# EAGLE schematic display_board (EAGLE 9.0.1)
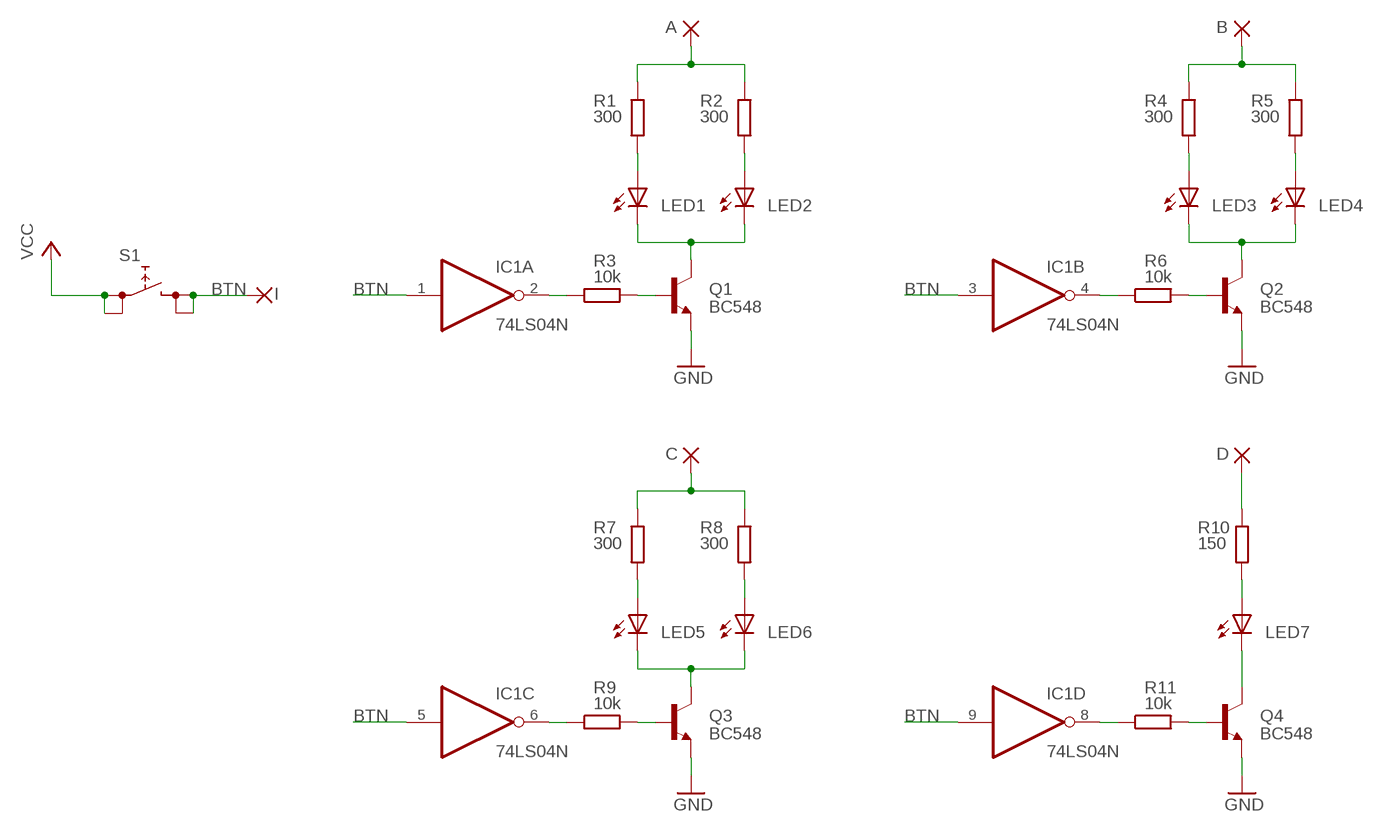
[diagram p0: schematic, sheet 1]

## Parts
A  1,6/0,9  [1,6/0,9]
B  1,6/0,9  [1,6/0,9]
C  1,6/0,9  [1,6/0,9]
D  1,6/0,9  [1,6/0,9]
I  1,6/0,9  [1,6/0,9]
IC1  74LS04N  [DIL14]
LED1  LED3MM  [LED3MM]
LED2  LED3MM  [LED3MM]
LED3  LED3MM  [LED3MM]
LED4  LED3MM  [LED3MM]
LED5  LED3MM  [LED3MM]
LED6  LED3MM  [LED3MM]
LED7  LED3MM  [LED3MM]
Q1  BC548  [TO92-EBC]
Q2  BC548  [TO92-EBC]
Q3  BC548  [TO92-EBC]
Q4  BC548  [TO92-EBC]
R1  300  R-EU_0207/10  [0207/10]
R2  300  R-EU_0207/10  [0207/10]
R3  10k  R-EU_0207/10  [0207/10]
R4  300  R-EU_0207/10  [0207/10]
R5  300  R-EU_0207/10  [0207/10]
R6  10k  R-EU_0207/10  [0207/10]
R7  300  R-EU_0207/10  [0207/10]
R8  300  R-EU_0207/10  [0207/10]
R9  10k  R-EU_0207/10  [0207/10]
R10  150  R-EU_0207/10  [0207/10]
R11  10k  R-EU_0207/10  [0207/10]
S1  REKN  [REKN]

## Nets
BTN: I.1(P) IC1.1(A:I) IC1.3(B:I) IC1.5(C:I) IC1.9(D:I) S1.1A S1.1B
GND: Q1.E Q2.E Q3.E Q4.E
N$1: Q3.B R9.2
N$2: LED1.A R1.2
N$3: Q1.B R3.2
N$4: LED5.A R7.2
N$5: LED2.A R2.2
N$6: LED1.K(C) LED2.K(C) Q1.C
N$7: Q2.B R6.2
N$8: LED3.A R4.2
N$9: LED4.A R5.2
N$10: LED3.K(C) LED4.K(C) Q2.C
N$11: IC1.4(B:O) R6.1
N$12: B.1(P) R4.1 R5.1
N$13: LED6.A R8.2
N$14: LED5.K(C) LED6.K(C) Q3.C
N$15: IC1.6(C:O) R9.1
N$16: D.1(P) R10.1
N$17: Q4.B R11.2
N$18: LED7.A R10.2
N$19: C.1(P) R7.1 R8.1
N$20: LED7.K(C) Q4.C
N$21: IC1.8(D:O) R11.1
N$23: IC1.2(A:O) R3.1
N$24: A.1(P) R1.1 R2.1
VCC: S1.0A S1.0B
Unconnected: IC1.10(E:O) IC1.11(E:I) IC1.12(F:O) IC1.13(F:I)

## Power pins joined to a net without a drawn wire
GND: IC1.7(P:GND)
VCC: IC1.14(P:VCC)

## Library data of the parts
A B C D I = wirepad:1,6/0,9: THROUGH-HOLE PAD
IC1 = 74xx-eu:74*04: Hex INVERTER
LED1-LED7 = led:LED: LED OSRAM: - CHIPLED LG R971, LG N971, LY N971, LG Q971, LY Q971, LO R971, LY R971 LH N974, LH R974 LS Q976, LO Q976, LY Q976 LO Q996 - Hyper CHIPLED LW Q18S LB Q993, LB Q99A, LB R99A - SideLED LS A670, LO A670, LY A670, LG A670, LP A670 LB A673, LV A673, LT A673, LW A673 LH A674 LY A675 LS A676, LA A676, LO A676, LY A676, LW A676 LS A679, LY A679, LG A679 - Hyper Micro SIDELED® LS Y876, LA Y876, LO Y876, LY Y876 LT Y87S - SmartLED LW L88C, LW L88S LB L89C, LB L89S, LG L890 LS L89K, LO L89K, LY L89K LS L896, LA L896, LO L896, LY L896 - TOPLED LS T670, LO T670, LY T670, LG T670, LP T670 LSG T670, LSP T670, LSY T670, LOP T670, LYG T670 LG T671, LOG T671, LSG T671 LB T673, LV T673, LT T673, LW T673 LH T674 LS T676, LA T676, LO T676, LY T676, LB T676, LH T676, LSB T676, LW T676 LB T67C, LV T67C, LT T67C, LS T67K, LO T67K, LY T67K, LW E67C LS E67B, LA E67B, LO E67B, LY E67B, LB E67C, LV E67C, LT E67C LW T67C LS T679, LY T679, LG T679 LS T770, LO T770, LY T770, LG T770, LP T770 LB T773, LV T773, LT T773, LW T773 LH T774 LS E675, LA E675, LY E675, LS T675 LS T776, LA T776, LO T776, LY T776, LB T776 LHGB T686 LT T68C, LB T68C - Hyper Mini TOPLED® LB M676 - Mini TOPLED Santana® LG M470 LS M47K, LO M47K, LY M47K Source: http://www.osram.convergy.de LUXEON: - LUMILED® LXK2-PW12-R00, LXK2-PW12-S00, LXK2-PW14-U00, LXK2-PW14-V00 LXK2-PM12-R00, LXK2-PM12-S00, LXK2-PM14-U00 LXK2-PE12-Q00, LXK2-PE12-R00, LXK2-PE12-S00, LXK2-PE14-T00, LXK2-PE14-U00 LXK2-PB12-K00, LXK2-PB12-L00, LXK2-PB12-M00, LXK2-PB14-N00, LXK2-PB14-P00, LXK2-PB14-Q00 LXK2-PR12-L00, LXK2-PR12-M00, LXK2-PR14-Q00, LXK2-PR14-R00 LXK2-PD12-Q00, LXK2-PD12-R00, LXK2-PD12-S00 LXK2-PH12-R00, LXK2-PH12-S00 LXK2-PL12-P00, LXK2-PL12-Q00, LXK2-PL12-R00 Source: www.luxeon.com KINGBRIGHT: KA-3528ASYC Source: www.kingbright.com
Q1-Q4 = transistor-npn:BC548*: NPN Transistor
R1-R11 = rcl:R-EU_: RESISTOR, European symbol; SPICEPREFIX: R
S1 = switch:REKN: PUSH SWITCH ITT-Cannon-Cannon